# Altium schematic sheet 415dk.SchDoc
size A4; DocumentNumber: 1; SheetNumber: 1; SheetTotal: 4
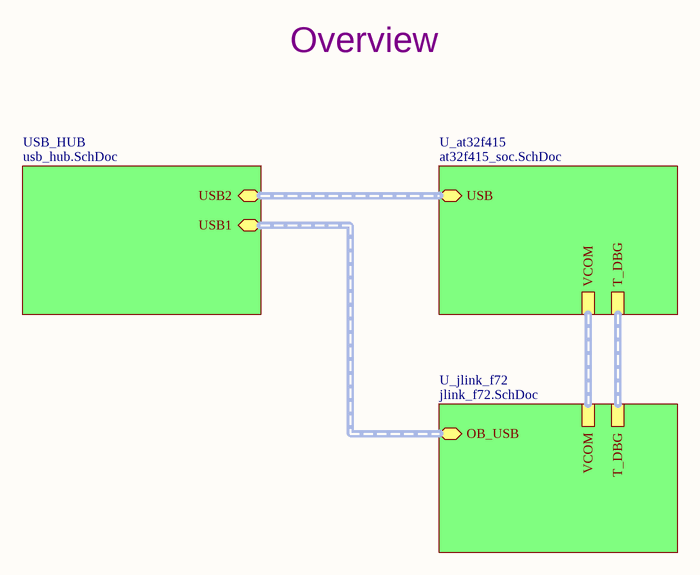
[diagram p0: 415dk.SchDoc]

## Sub-sheets
U_at32f415 = at32f415_soc.SchDoc: T_DBG (harness DBG_PORT), VCOM (harness VCOM), USB (harness USB)
U_jlink_f72 = jlink_f72.SchDoc: T_DBG (harness DBG_PORT), VCOM (harness VCOM), OB_USB (harness USB)
USB_HUB = usb_hub.SchDoc: USB1, USB2

## Buses and harness runs
harness sheet U_at32f415/T_DBG = sheet U_jlink_f72/T_DBG
harness sheet U_at32f415/USB = sheet USB_HUB/USB2
harness sheet U_at32f415/VCOM = sheet U_jlink_f72/VCOM
harness sheet U_jlink_f72/OB_USB = sheet USB_HUB/USB1

## Notes on the sheet
- Overview